# EAGLE board LED Cube (EAGLE 6.0), part 1 of 2
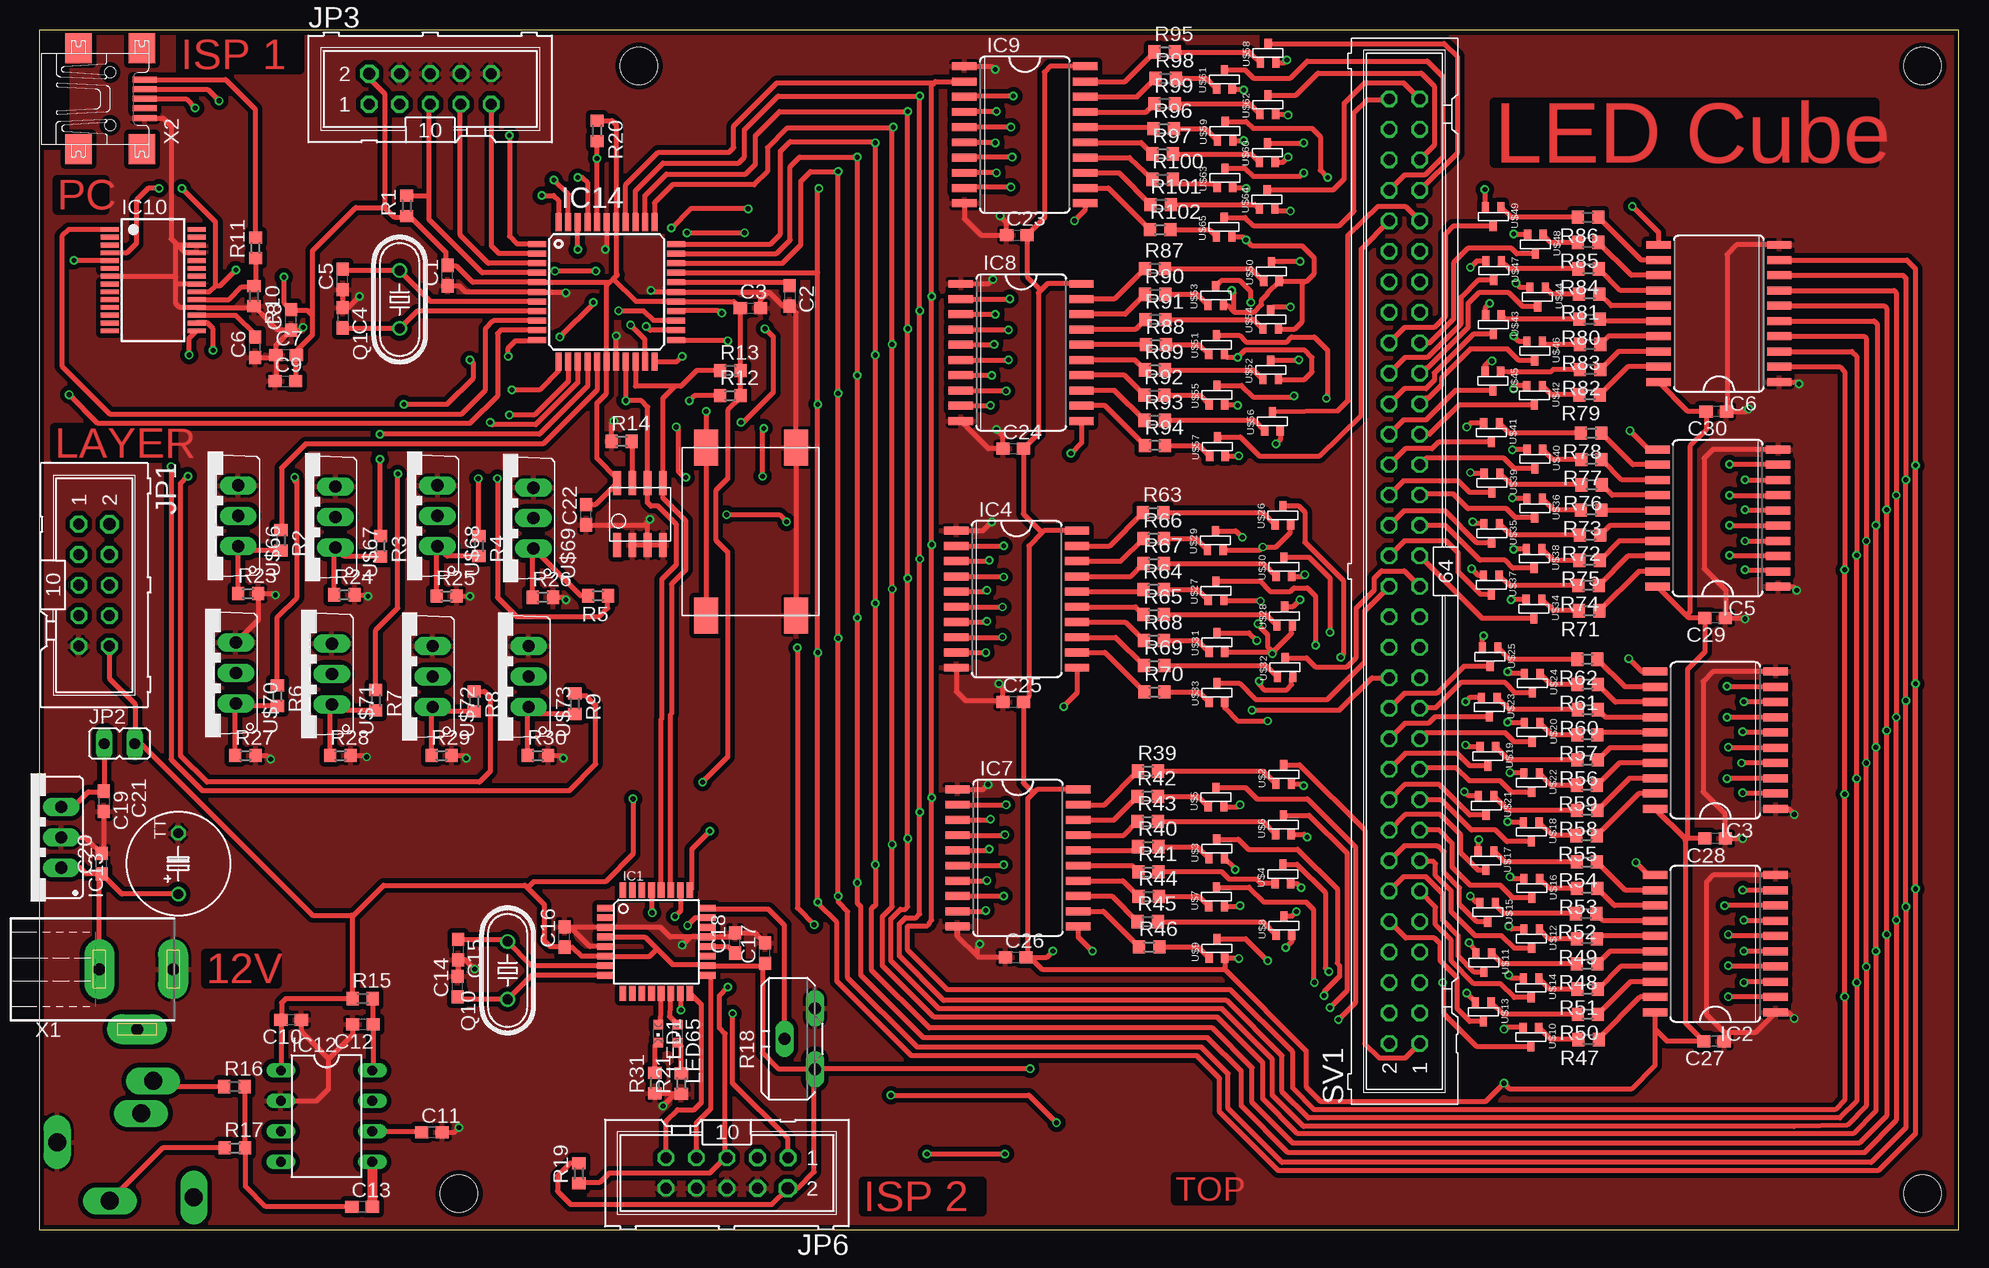
[diagram p2: board, top side]
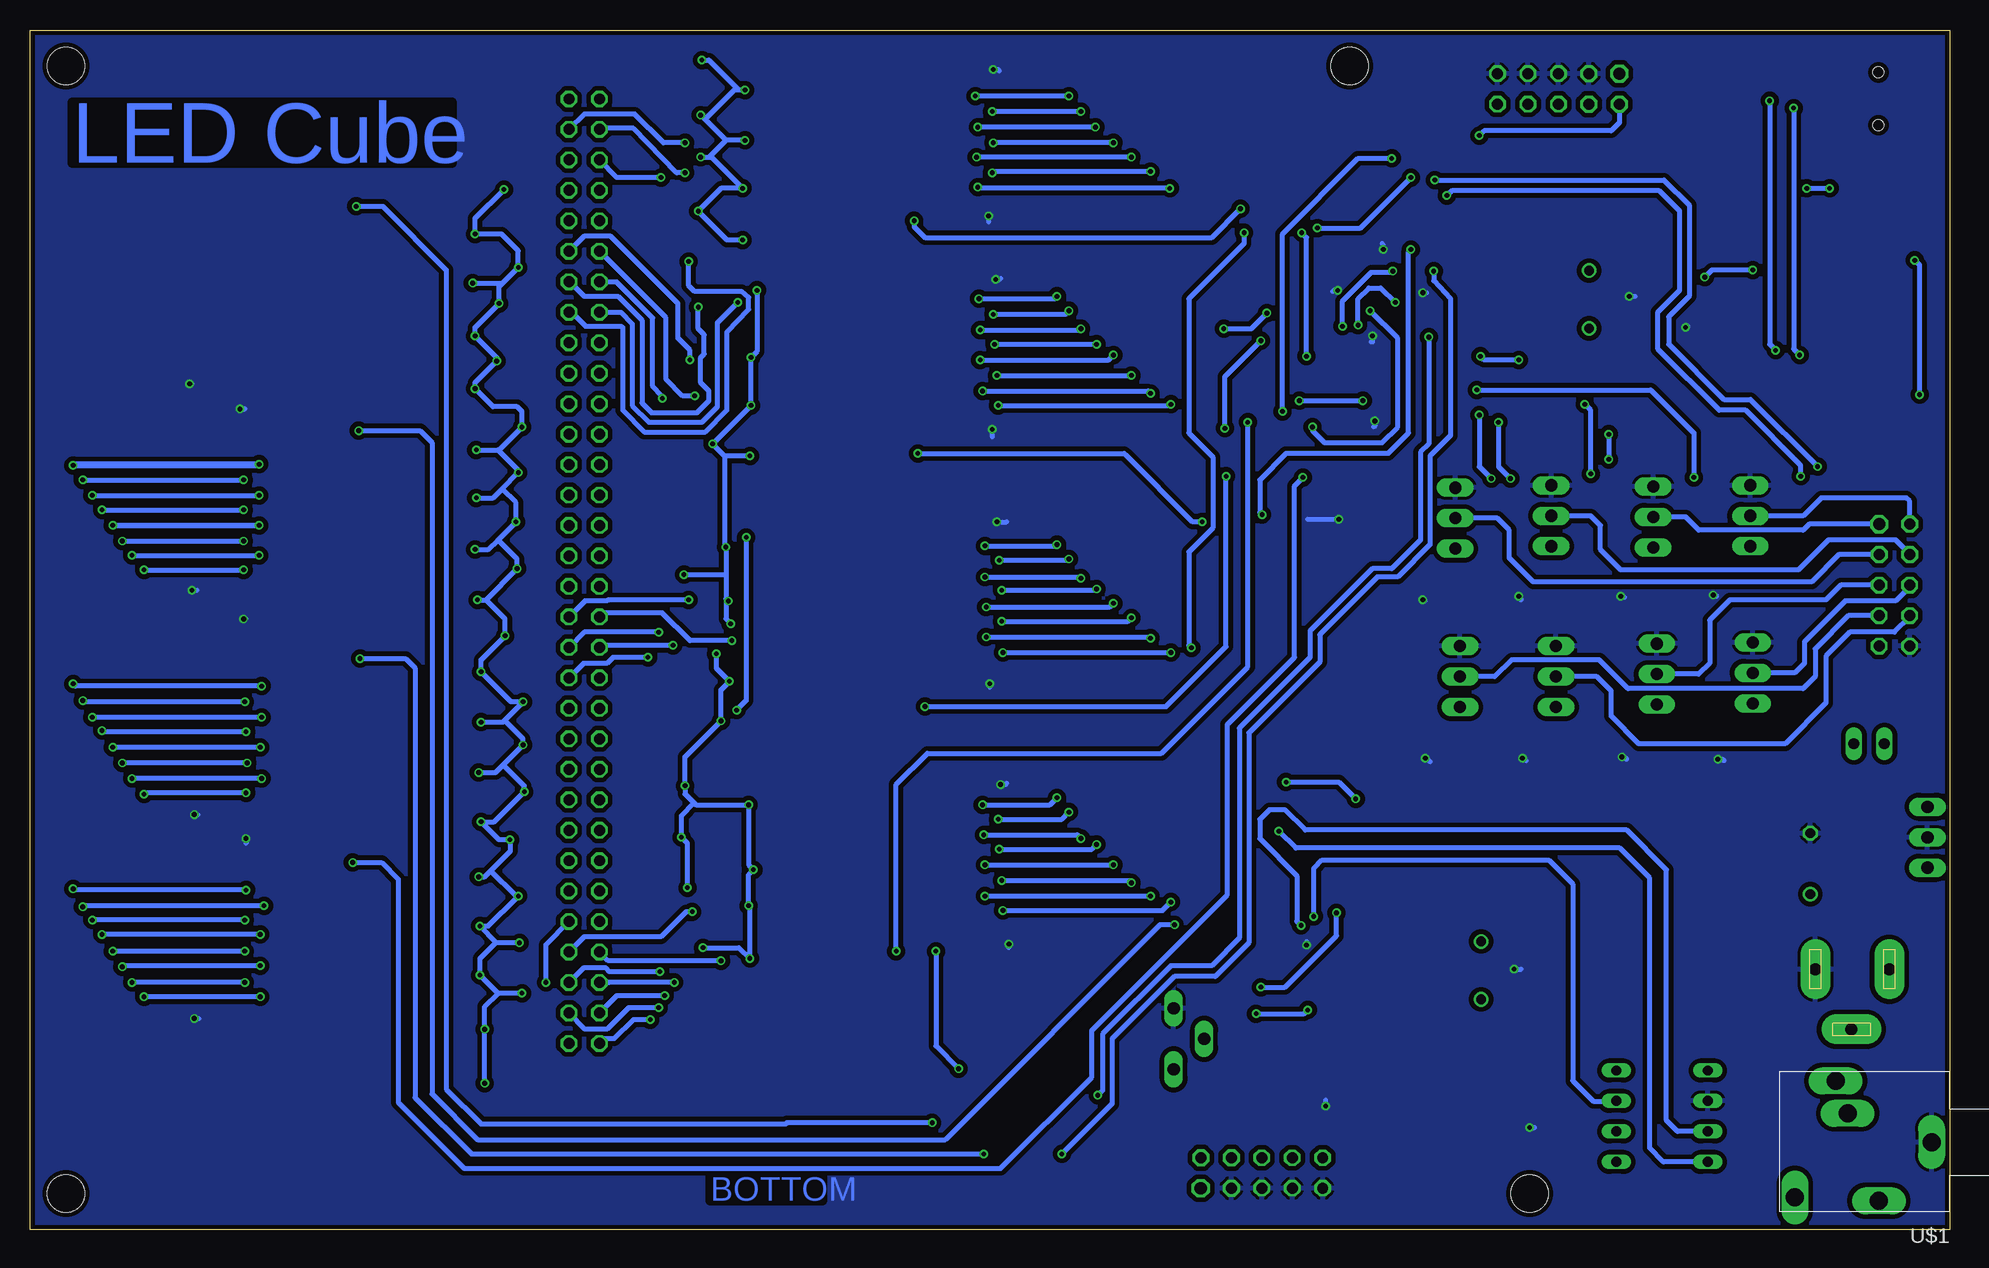
[diagram p3: board, bottom side, seen from below]

Size 160 x 100 mm. Coordinates in mm from the lower left corner, seen from the top.
Outline: 0,0 160,0 160,100 0,100 0,0
Copper layers (1*16): Top 0.035mm / dielectric 1.5mm / Bottom 0.035mm
Design rules: minimum track width 0.15mm, minimum drill 0.3mm, track to track 0.15mm, track to pad 0.15mm, pad to pad 0.15mm, via to via 0.15mm, smd to smd 0.1mm, copper to edge 0.15mm, drill to drill 0.15mm, minimum pad ring 0.15mm, minimum via ring 0.15mm, stop-mask expansion 4mil, vias tented up to drill 0mil, thermal gap 10mil
Holes 3.1 mm at 157,97 157,3 50,97 35,3

## Footprints (pad centres in the part's own frame; a part is rotated, then mirrored left to right if it is on the bottom)
C0603 = smd 1.1 x 1: 1 -0.85,0; 2 0.85,0
TAP5-80 = drill 0.813: + -2.54,0 | drill 0.813 octagon: - 2.54,0
TQFP32-08 = smd 1.27 x 0.559: 1 -4.293,2.8; 2 -4.293,2; 3 -4.293,1.2; 4 -4.293,0.4; 5 -4.293,-0.4; 6 -4.293,-1.2; 7 -4.293,-2; 8 -4.293,-2.8; 17 4.293,-2.8; 18 4.293,-2; 19 4.293,-1.2; 20 4.293,-0.4; 21 4.293,0.4; 22 4.293,1.2; 23 4.293,2; 24 4.293,2.8 | smd 0.559 x 1.27: 9 -2.8,-4.293; 10 -2,-4.293; 11 -1.2,-4.293; 12 -0.4,-4.293; 13 0.4,-4.293; 14 1.2,-4.293; 15 2,-4.293; 16 2.8,-4.293; 25 2.8,4.293; 26 2,4.293; 27 1.2,4.293; 28 0.4,4.293; 29 -0.4,4.293; 30 -1.2,4.293; 31 -2,4.293; 32 -2.8,4.293
SO20W = smd 0.66 x 2.032: 1 -5.715,-5.029; 2 -4.445,-5.029; 3 -3.175,-5.029; 4 -1.905,-5.029; 5 -0.635,-5.029; 6 0.635,-5.029; 7 1.905,-5.029; 8 3.175,-5.029; 9 4.445,-5.029; 10 5.715,-5.029; 11 5.715,5.029; 12 4.445,5.029; 13 3.175,5.029; 14 1.905,5.029; 15 0.635,5.029; 16 -0.635,5.029; 17 -1.905,5.029; 18 -3.175,5.029; 19 -4.445,5.029; 20 -5.715,5.029
SSOP28 = smd 0.4 x 1.5: 1 -4.225,-3.625; 2 -3.575,-3.625; 3 -2.925,-3.625; 4 -2.275,-3.625; 5 -1.625,-3.625; 6 -0.975,-3.625; 7 -0.325,-3.625; 8 0.325,-3.625; 9 0.975,-3.625; 10 1.625,-3.625; 11 2.275,-3.625; 12 2.925,-3.625; 13 3.575,-3.625; 14 4.225,-3.625; 15 4.225,3.625; 16 3.575,3.625; 17 2.925,3.625; 18 2.275,3.625; 19 1.625,3.625; 20 0.975,3.625; 21 0.325,3.625; 22 -0.325,3.625; 23 -0.975,3.625; 24 -1.625,3.625; 25 -2.275,3.625; 26 -2.925,3.625; 27 -3.575,3.625; 28 -4.225,3.625
SOIC8 = smd 0.65 x 2: PA 0.635,-1; PB 1.905,-1; PC 3.175,-1; PD 4.445,-1; PE 4.445,4.2; PF 3.175,4.2; PG 1.905,4.2; PH 0.635,4.2
DIP8 = drill 0.813 long: 1 -3.81,-3.81; 2 -1.27,-3.81; 3 1.27,-3.81; 4 3.81,-3.81; 5 3.81,3.81; 6 1.27,3.81; 7 -1.27,3.81; 8 -3.81,3.81
78XXS = drill 1.016 long: GND 0,-2.54; IN -2.54,-2.54; OUT 2.54,-2.54
TQFP44 = smd 1.5 x 0.5: 1 -5.8,4; 2 -5.8,3.2; 3 -5.8,2.4; 4 -5.8,1.6; 5 -5.8,0.8; 6 -5.8,0; 7 -5.8,-0.8; 8 -5.8,-1.6; 9 -5.8,-2.4; 10 -5.8,-3.2; 11 -5.8,-4; 23 5.8,-4; 24 5.8,-3.2; 25 5.8,-2.4; 26 5.8,-1.6; 27 5.8,-0.8; 28 5.8,0; 29 5.8,0.8; 30 5.8,1.6; 31 5.8,2.4; 32 5.8,3.2; 33 5.8,4 | smd 0.5 x 1.5: 12 -4,-5.8; 13 -3.2,-5.8; 14 -2.4,-5.8; 15 -1.6,-5.8; 16 -0.8,-5.8; 17 0,-5.8; 18 0.8,-5.8; 19 1.6,-5.8; 20 2.4,-5.8; 21 3.2,-5.8; 22 4,-5.8; 34 4,5.8; 35 3.2,5.8; 36 2.4,5.8; 37 1.6,5.8; 38 0.8,5.8; 39 0,5.8; 40 -0.8,5.8; 41 -1.6,5.8; 42 -2.4,5.8; 43 -3.2,5.8; 44 -4,5.8
ML10 = drill 0.914 pad 1.422 octagon: 1 -5.08,-1.27; 3 -2.54,-1.27; 4 -2.54,1.27 | drill 1.016 pad 1.422 octagon: 2 -5.08,1.27 | drill 0.914 octagon: 5 0,-1.27; 6 0,1.27; 7 2.54,-1.27; 8 2.54,1.27; 9 5.08,-1.27; 10 5.08,1.27
JP1 = drill 0.914 long: 1 0,-1.27; 2 0,1.27
CHIPLED_0603 = smd 0.8 x 0.8: A 0,-0.75; C 0,0.75
HC49/S = drill 0.813: 1 -2.413,0; 2 2.413,0
R0603 = smd 1 x 1.1: 1 -0.85,0; 2 0.85,0
PT-10S = drill 1.016 long: A -2.54,-1.27; E 2.54,-1.27; S 0,1.27
ML64 = drill 0.914 octagon: 1 -39.37,-1.27; 2 -39.37,1.27; 3 -36.83,-1.27; 4 -36.83,1.27; 5 -34.29,-1.27; 6 -34.29,1.27; 7 -31.75,-1.27; 8 -31.75,1.27; 9 -29.21,-1.27; 10 -29.21,1.27; 11 -26.67,-1.27; 12 -26.67,1.27; 13 -24.13,-1.27; 14 -24.13,1.27; 15 -21.59,-1.27; 16 -21.59,1.27; 17 -19.05,-1.27; 18 -19.05,1.27; 19 -16.51,-1.27; 20 -16.51,1.27; 21 -13.97,-1.27; 22 -13.97,1.27; 23 -11.43,-1.27; 24 -11.43,1.27; 25 -8.89,-1.27; 26 -8.89,1.27; 27 -6.35,-1.27; 28 -6.35,1.27; 29 -3.81,-1.27; 30 -3.81,1.27; 31 -1.27,-1.27; 32 -1.27,1.27; 33 1.27,-1.27; 34 1.27,1.27; 35 3.81,-1.27; 36 3.81,1.27; 37 6.35,-1.27; 38 6.35,1.27; 39 8.89,-1.27; 40 8.89,1.27; 41 11.43,-1.27; 42 11.43,1.27; 43 13.97,-1.27; 44 13.97,1.27; 45 16.51,-1.27; 46 16.51,1.27; 47 19.05,-1.27; 48 19.05,1.27; 49 21.59,-1.27; 50 21.59,1.27; 51 24.13,-1.27; 52 24.13,1.27; 53 26.67,-1.27; 54 26.67,1.27; 55 29.21,-1.27; 56 29.21,1.27; 57 31.75,-1.27; 58 31.75,1.27; 59 34.29,-1.27; 60 34.29,1.27; 61 36.83,-1.27; 62 36.83,1.27; 63 39.37,-1.27; 64 39.37,1.27
KLINKEPRINT = drill 1.5 pad 1.778 long: CONLEFT 12.9,10.45; CONRIGHT 8.5,3.45; GND 1.5,5.85; LEFT 5.9,10.75; RIGHT 9.5,0.75
SOT323 = smd 0.6 x 0.8: P$1 -0.65,-0.65; P$2 0.65,-0.65; P$3 0,0.95
TO220-3V = drill 1.016 long: 1 -2.54,0; 2 0,0; 3 2.54,0
SMDTASTER = smd 3 x 2: A 0,7.5; A2 14,7.5; B 0,0; B2 14,0
733980-62 = drill 1 pad 2.5 long: 1 0,8.57; 2 0,2.42; 3 5,5.57
USB-B-MINI-SMD = smd 2 x 0.5: 1 2.9,1.6; 2 2.9,0.8; 3 2.9,0; 4 2.9,-0.8; 5 2.9,-1.6 | smd 2.2 x 2.5: M1 -2.65,-4.2; M2 -2.65,4.2; M3 2.65,4.2; M4 2.65,-4.2 | hole 0.9: 0,2.2; 0,-2.2

## Placement (x,y rotation side)
C1  100n  [C0603]  34.04,79.52 90 top
C2  100n  [C0603]  62.56,77.83 270 top
C3  100n  [C0603]  59.29,76.81 0 top
C4  22p  [C0603]  25.31,76.01 270 top
C5  22p  [C0603]  25.29,79.21 90 top
C6  100n  [C0603]  17.99,73.54 90 top
C7  100n  [C0603]  20.59,72.91 0 top
C8  100n  [C0603]  20.99,75.84 90 top
C9  4u7  [C0603]  20.53,70.71 0 top
C10  100n  [C0603]  21.01,17.49 180 top
C11  100n  [C0603]  32.74,8.11 0 top
C12  33p  [C0603]  26.99,17.09 180 top
C13  10n  [C0603]  26.93,1.91 0 top
C14  12p  [C0603]  34.89,20.25 90 top
C15  12p  [C0603]  34.91,23.33 270 top
C16  100n  [C0603]  43.79,24.39 90 top
C17  100n  [C0603]  60.49,23.04 90 top
C18  100n  [C0603]  57.99,23.89 90 top
C19  100n  [C0603]  5.4,35.7 270 top
C20  100n  [C0603]  5.2,30.5 90 top
C21  4u7  [TAP5-80]  11.6,30.5 90 top
C22  100n  [C0603]  45.6,59.6 90 top
C23  100n  [C0603]  81.5,82.9 0 top
C24  100n  [C0603]  81.2,65.1 0 top
C25  100n  [C0603]  81.2,44 0 top
C26  100n  [C0603]  81.4,22.7 0 top
C27  100n  [C0603]  139.6,15.7 180 top
C28  100n  [C0603]  139.7,32.6 180 top
C29  100n  [C0603]  139.7,51 180 top
C30  100n  [C0603]  139.8,68.2 180 top
IC1  MEGA8-AI  [TQFP32-08]  51.45,23.99 0 top
IC2  74HC573D  [SO20W]  139.72,23.83 90 top
IC3  74HC573D  [SO20W]  139.72,40.79 90 top
IC4  74HC573D  [SO20W]  81.48,52.55 270 top
IC5  74HC573D  [SO20W]  139.92,59.31 90 top
IC6  74HC573D  [SO20W]  140.02,76.37 90 top
IC7  74HC573D  [SO20W]  81.58,30.97 270 top
IC8  74HC573D  [SO20W]  81.86,73.12 270 top
IC9  74HC573D  [SO20W]  82.16,91.26 270 top
IC10  FT232RL  [SSOP28]  9.49,79.15 270 top
IC11  FM24V10  [SOIC8]  47.55,58.05 0 top
IC12  MSGEQ7  [DIP8]  23.96,9.45 270 top
IC13  [78XXS]  -0.7,32.7 90 top
IC14  MEGA32-A  [TQFP44]  47.3,78.16 0 top
JP1  [ML10]  4.59,53.72 270 top
JP2  [JP1]  6.7,40.5 270 top
JP3  AVR-ISP  [ML10]  32.6,95.09 0 top
JP6  AVR-ISP  [ML10]  57.33,4.71 180 top
LED1  [CHIPLED_0603]  51.6,16.35 180 top
LED65  [CHIPLED_0603]  53.22,16.35 180 top
Q1  [HC49/S]  30.05,77.53 90 top
Q10  [HC49/S]  39.05,21.6 90 top
R1  10k  [R0603]  30.64,85.35 90 top
R2  15  [R0603]  20.16,57.46 270 top
R3  15  [R0603]  28.46,56.97 270 top
R4  15  [R0603]  36.66,56.98 270 top
R5  15  [R0603]  46.59,52.84 180 top
R6  15  [R0603]  19.86,44.5 270 top
R7  15  [R0603]  28.06,44.11 270 top
R8  15  [R0603]  36.26,44.02 270 top
R9  15  [R0603]  44.66,43.83 270 top
R10  10k  [R0603]  17.91,77.81 270 top
R11  4k7  [R0603]  18.04,81.83 90 top
R12  2k  [R0603]  57.61,69.51 0 top
R13  2k  [R0603]  57.63,71.61 0 top
R14  1k  [R0603]  48.55,65.71 0 top
R15  200k  [R0603]  26.97,19.25 0 top
R16  200k  [R0603]  16.29,11.91 0 top
R17  200k  [R0603]  16.31,6.81 0 top
R18  [PT-10S]  63.4,15.9 90 top
R19  10k  [R0603]  44.99,4.69 90 top
R20  1k  [R0603]  46.51,91.59 270 top
R21  1k  [R0603]  53.53,12.18 90 top
R23  100k  [R0603]  17.43,53.01 0 top
R24  100k  [R0603]  25.45,52.91 0 top
R25  100k  [R0603]  33.97,52.81 0 top
R26  100k  [R0603]  41.99,52.71 0 top
R27  100k  [R0603]  17.21,39.51 0 top
R28  100k  [R0603]  25.13,39.51 0 top
R29  100k  [R0603]  33.55,39.51 0 top
R30  100k  [R0603]  41.57,39.51 0 top
R31  1k  [R0603]  51.33,12.22 90 top
R39  1k  [R0603]  92.43,38.21 0 top
R40  1k  [R0603]  92.45,31.91 0 top
R41  1k  [R0603]  92.47,29.81 0 top
R42  1k  [R0603]  92.39,36.11 0 top
R43  1k  [R0603]  92.41,34.01 0 top
R44  1k  [R0603]  92.49,27.76 0 top
R45  1k  [R0603]  92.41,25.66 0 top
R46  1k  [R0603]  92.53,23.56 0 top
R47  1k  [R0603]  129.15,15.84 180 top
R48  1k  [R0603]  129.03,22.14 180 top
R49  1k  [R0603]  129.01,24.24 180 top
R50  1k  [R0603]  129.09,17.94 180 top
R51  1k  [R0603]  129.07,20.04 180 top
R52  1k  [R0603]  128.95,26.34 180 top
R53  1k  [R0603]  129.03,28.44 180 top
R54  1k  [R0603]  129.01,30.64 180 top
R55  1k  [R0603]  128.99,32.84 180 top
R56  1k  [R0603]  129.07,39.14 180 top
R57  1k  [R0603]  129.05,41.24 180 top
R58  1k  [R0603]  129.03,34.94 180 top
R59  1k  [R0603]  129.01,37.04 180 top
R60  1k  [R0603]  129.09,43.34 180 top
R61  1k  [R0603]  129.07,45.44 180 top
R62  1k  [R0603]  129.05,47.54 180 top
R63  1k  [R0603]  92.87,59.76 0 top
R64  1k  [R0603]  92.89,53.36 0 top
R65  1k  [R0603]  92.91,51.26 0 top
R66  1k  [R0603]  92.89,57.61 0 top
R67  1k  [R0603]  92.91,55.51 0 top
R68  1k  [R0603]  92.93,49.11 0 top
R69  1k  [R0603]  92.95,47.01 0 top
R70  1k  [R0603]  92.97,44.81 0 top
R71  1k  [R0603]  129.21,51.59 180 top
R72  1k  [R0603]  129.29,57.89 180 top
R73  1k  [R0603]  129.37,59.99 180 top
R74  1k  [R0603]  129.15,53.69 180 top
R75  1k  [R0603]  129.23,55.79 180 top
R76  1k  [R0603]  129.41,62.09 180 top
R77  1k  [R0603]  129.39,64.19 180 top
R78  1k  [R0603]  129.37,66.39 180 top
R79  1k  [R0603]  129.25,69.59 180 top
R80  1k  [R0603]  129.23,75.89 180 top
R81  1k  [R0603]  129.21,77.99 180 top
R82  1k  [R0603]  129.29,71.69 180 top
R83  1k  [R0603]  129.27,73.79 180 top
R84  1k  [R0603]  129.15,80.09 180 top
R85  1k  [R0603]  129.13,82.29 180 top
R86  1k  [R0603]  129.11,84.39 180 top
R87  1k  [R0603]  93.01,80.11 0 top
R88  1k  [R0603]  93.09,73.76 0 top
R89  1k  [R0603]  93.01,71.66 0 top
R90  1k  [R0603]  93.03,77.96 0 top
R91  1k  [R0603]  93.05,75.86 0 top
R92  1k  [R0603]  92.97,69.56 0 top
R93  1k  [R0603]  92.99,67.46 0 top
R94  1k  [R0603]  93.01,65.36 0 top
R95  1k  [R0603]  93.83,98.16 0 top
R96  1k  [R0603]  93.75,91.76 0 top
R97  1k  [R0603]  93.67,89.66 0 top
R98  1k  [R0603]  93.89,95.96 0 top
R99  1k  [R0603]  93.81,93.86 0 top
R100  1k  [R0603]  93.65,87.55 0 top
R101  1k  [R0603]  93.5,85.45 0 top
R102  1k  [R0603]  93.45,83.35 0 top
SV1  [ML64]  113.81,54.88 90 top
U$1  KLINKENBUCHSE  [KLINKEPRINT]  -0.01,13.13 180 bottom
U$2  PNP  [SOT323]  103.74,37.79 0 top
U$3  PNP  [SOT323]  98.16,31.59 0 top
U$4  PNP  [SOT323]  103.68,29.49 0 top
U$5  PNP  [SOT323]  98.1,35.89 0 top
U$6  PNP  [SOT323]  103.72,33.59 0 top
U$7  PNP  [SOT323]  98.14,27.59 0 top
U$8  PNP  [SOT323]  103.76,25.19 0 top
U$9  PNP  [SOT323]  98.18,23.29 0 top
U$10  PNP  [SOT323]  124.34,16.2 180 top
U$11  PNP  [SOT323]  120.42,22.4 180 top
U$12  PNP  [SOT323]  124.4,24.4 180 top
U$13  PNP  [SOT323]  120.38,18.3 180 top
U$14  PNP  [SOT323]  124.36,20.3 180 top
U$15  PNP  [SOT323]  120.74,26.6 180 top
U$16  PNP  [SOT323]  124.42,28.6 180 top
U$17  PNP  [SOT323]  120.6,30.9 180 top
U$18  PNP  [SOT323]  124.38,33.3 180 top
U$19  PNP  [SOT323]  120.76,39.6 180 top
U$20  PNP  [SOT323]  124.44,41.6 180 top
U$21  PNP  [SOT323]  120.62,35.5 180 top
U$22  PNP  [SOT323]  124.4,37.4 180 top
U$23  PNP  [SOT323]  120.88,43.7 180 top
U$24  PNP  [SOT323]  124.46,45.7 180 top
U$25  PNP  [SOT323]  120.94,47.9 180 top
U$26  PNP  [SOT323]  103.68,59.4 0 top
U$27  PNP  [SOT323]  98.1,53.1 0 top
U$28  PNP  [SOT323]  103.82,51 0 top
U$29  PNP  [SOT323]  98.04,57.3 0 top
U$30  PNP  [SOT323]  103.76,55.1 0 top
U$31  PNP  [SOT323]  98.18,48.8 0 top
U$32  PNP  [SOT323]  103.86,46.71 0 top
U$33  PNP  [SOT323]  98.18,44.61 0 top
U$34  PNP  [SOT323]  124.6,51.89 180 top
U$35  PNP  [SOT323]  121.08,58.19 180 top
U$36  PNP  [SOT323]  124.66,60.29 180 top
U$37  PNP  [SOT323]  121.04,53.89 180 top
U$38  PNP  [SOT323]  124.62,56.09 180 top
U$39  PNP  [SOT323]  121.1,62.39 180 top
U$40  PNP  [SOT323]  124.68,64.39 180 top
U$41  PNP  [SOT323]  121.06,66.59 180 top
U$42  PNP  [SOT323]  124.64,69.69 180 top
U$43  PNP  [SOT323]  121.22,75.59 180 top
U$44  PNP  [SOT323]  124.9,77.89 180 top
U$45  PNP  [SOT323]  121.18,70.89 180 top
U$46  PNP  [SOT323]  124.66,73.39 180 top
U$47  PNP  [SOT323]  121.24,80.09 180 top
U$48  PNP  [SOT323]  124.72,82.29 180 top
U$49  PNP  [SOT323]  121.2,84.59 180 top
U$50  PNP  [SOT323]  102.72,79.71 0 top
U$51  PNP  [SOT323]  98.14,73.61 0 top
U$52  PNP  [SOT323]  102.66,71.51 0 top
U$53  PNP  [SOT323]  98.08,77.71 0 top
U$54  PNP  [SOT323]  102.66,75.72 0 top
U$55  PNP  [SOT323]  98.18,69.42 0 top
U$56  PNP  [SOT323]  102.8,67.22 0 top
U$57  PNP  [SOT323]  98.22,65.12 0 top
U$58  PNP  [SOT323]  102.44,97.92 0 top
U$59  PNP  [SOT323]  98.86,91.42 0 top
U$60  PNP  [SOT323]  102.38,89.62 0 top
U$61  PNP  [SOT323]  98.8,95.72 0 top
U$62  PNP  [SOT323]  102.42,93.62 0 top
U$63  PNP  [SOT323]  98.84,87.52 0 top
U$64  PNP  [SOT323]  102.36,85.72 0 top
U$65  PNP  [SOT323]  98.78,83.42 0 top
U$66  IRF530  [TO220-3V]  16.6,59.5 90 top
U$67  IRF530  [TO220-3V]  24.7,59.4 90 top
U$68  IRF530  [TO220-3V]  33.2,59.5 90 top
U$69  IRF530  [TO220-3V]  41.2,59.3 90 top
U$70  IRF530  [TO220-3V]  16.4,46.4 90 top
U$71  IRF530  [TO220-3V]  24.4,46.3 90 top
U$72  IRF530  [TO220-3V]  32.8,46.1 90 top
U$73  IRF530  [TO220-3V]  40.8,46.1 90 top
U$74  TASTER  [SMDTASTER]  63.1,51.2 90 top
X1  [733980-62]  2.6,21.7 270 top
X2  [USB-B-MINI-SMD]  5.92,94.26 0 top